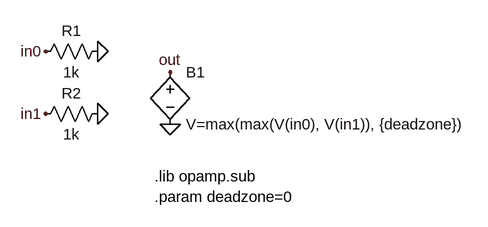
[diagram p0: schematic max.asc]
max.asc, the LTspice schematic file:
Version 4
SHEET 1 880 680
FLAG -48 80 in0
FLAG 32 80 0
FLAG -48 176 in1
FLAG 32 176 0
FLAG 144 192 0
FLAG 144 112 out
SYMBOL res 48 64 R90
WINDOW 0 0 56 VBottom 2
WINDOW 3 32 56 VTop 2
SYMATTR InstName R1
SYMATTR Value 1k
SYMBOL res 48 160 R90
WINDOW 0 0 56 VBottom 2
WINDOW 3 32 56 VTop 2
SYMATTR InstName R2
SYMATTR Value 1k
SYMBOL bv 144 96 R0
SYMATTR InstName B1
SYMATTR Value V=max(max(V(in0), V(in1)), {deadzone})
TEXT 120 272 Left 2 !.lib opamp.sub\n.param deadzone=0

The netlist it stands for:
* max.asc
R1 0 in0 1k
R2 0 in1 1k
B1 out 0 V=max(max(V(in0), V(in1)), {deadzone})
.lib opamp.sub
.param deadzone=0
.backanno
.end